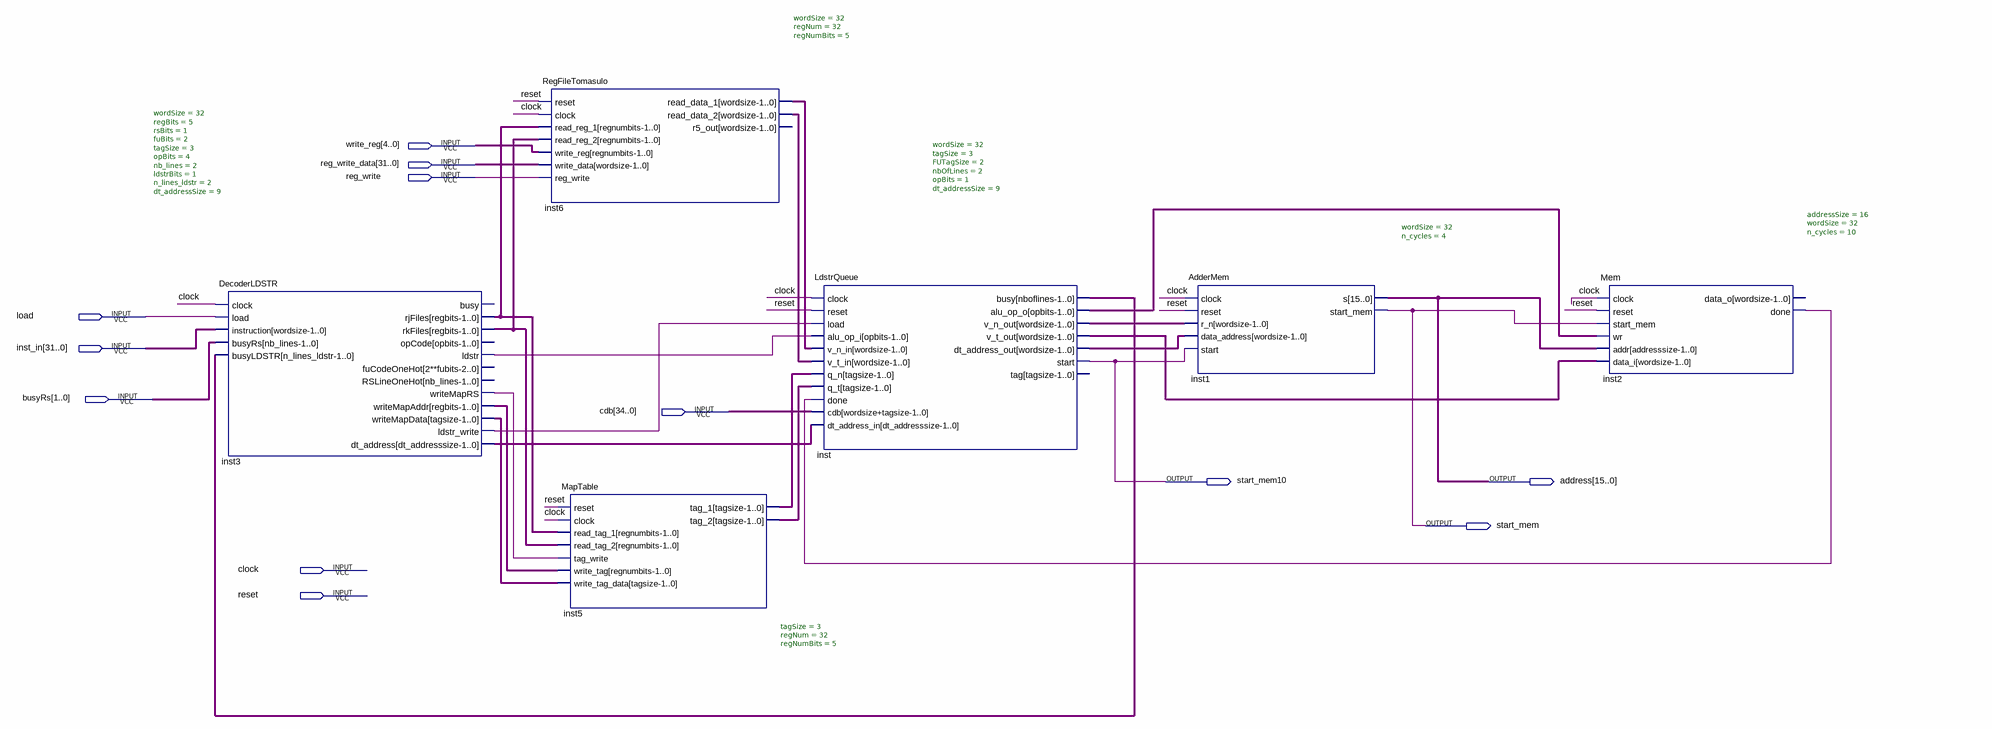
[diagram p0: schematic sheet]
// Quartus schematic Ldstr.bdf as structural Verilog: 6 symbols, 12 pins
module Ldstr (
  input  [4:0] write_reg,
  input  [31:0] reg_write_data,
  input  reg_write,
  input  load,
  input  [31:0] inst_in,
  input  [1:0] busyRs,
  input  [34:0] cdb,
  input  clock,
  input  reset,
  output start_mem10,
  output [15:0] address,
  output start_mem
);

  wire inst2_done, inst3_ldstr, inst3_ldstr_write, inst3_writemaprs, inst_alu_op_o;
  wire [1:0] inst_busy;
  wire [2:0] inst3_writemapdata, inst5_tag_1, inst5_tag_2;
  wire [4:0] inst3_rjfiles, inst3_rkfiles, inst3_writemapaddr;
  wire [8:0] inst3_dt_address;
  wire [31:0] inst6_read_data_1, inst6_read_data_2, inst_dt_address_out, inst_v_n_out, inst_v_t_out;

  DecoderLDSTR #(.wordSize(32), .regBits(5), .rsBits(1), .fuBits(2), .tagSize(3), .opBits(4), .nb_lines(2), .ldstrBits(1), .n_lines_ldstr(2), .dt_addressSize(9)) inst3 (
    .clock(clock), .load(load), .instruction(inst_in), .busyRs(busyRs), .busyLDSTR(inst_busy),
    .rjFiles(inst3_rjfiles), .rkFiles(inst3_rkfiles), .ldstr(inst3_ldstr), .writeMapRS(inst3_writemaprs),
    .writeMapAddr(inst3_writemapaddr), .writeMapData(inst3_writemapdata), .ldstr_write(inst3_ldstr_write),
    .dt_address(inst3_dt_address));  // open: busy, opCode, fuCodeOneHot, RSLineOneHot
  RegFileTomasulo #(.wordSize(32), .regNum(32), .regNumBits(5)) inst6 (
    .reset(reset), .clock(clock), .read_reg_1(inst3_rjfiles), .read_reg_2(inst3_rkfiles),
    .write_reg(write_reg), .write_data(reg_write_data), .reg_write(reg_write),
    .read_data_1(inst6_read_data_1), .read_data_2(inst6_read_data_2));  // open: r5_out
  MapTable #(.tagSize(3), .regNum(32), .regNumBits(5)) inst5 (
    .reset(reset), .clock(clock), .read_tag_1(inst3_rjfiles), .read_tag_2(inst3_rkfiles),
    .tag_write(inst3_writemaprs), .write_tag(inst3_writemapaddr), .write_tag_data(inst3_writemapdata),
    .tag_1(inst5_tag_1), .tag_2(inst5_tag_2));
  LdstrQueue #(.wordSize(32), .tagSize(3), .FUTagSize(2), .nbOfLines(2), .opBits(1), .dt_addressSize(9)) inst (
    .clock(clock), .reset(reset), .load(inst3_ldstr_write), .alu_op_i(inst3_ldstr),
    .v_n_in(inst6_read_data_1), .v_t_in(inst6_read_data_2), .q_n(inst5_tag_1), .q_t(inst5_tag_2),
    .done(inst2_done), .cdb(cdb), .dt_address_in(inst3_dt_address), .busy(inst_busy),
    .alu_op_o(inst_alu_op_o), .v_n_out(inst_v_n_out), .v_t_out(inst_v_t_out),
    .dt_address_out(inst_dt_address_out), .start(start_mem10));  // open: tag
  AdderMem #(.wordSize(32), .n_cycles(4)) inst1 (
    .clock(clock), .reset(reset), .r_n(inst_v_n_out), .data_address(inst_dt_address_out),
    .start(start_mem10), .s(address), .start_mem(start_mem));
  Mem #(.addressSize(16), .wordSize(32), .n_cycles(10)) inst2 (
    .clock(clock), .reset(reset), .start_mem(start_mem), .wr(inst_alu_op_o), .addr(address),
    .data_i(inst_v_t_out), .done(inst2_done));  // open: data_o
endmodule
